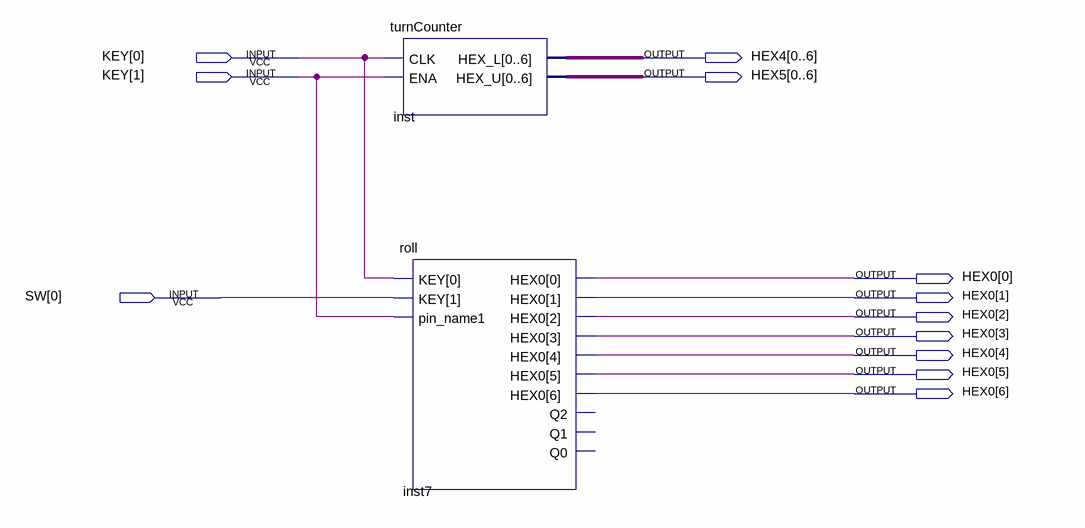
[diagram p0: schematic sheet]
// Quartus schematic lab6.bdf as structural Verilog: 2 symbols, 12 pins
module lab6 (
  input  [1:0] KEY,
  input  [0:0] SW,
  output [0:6] HEX4,
  output [0:6] HEX5,
  output [6:0] HEX0
);

  turnCounter inst (.CLK(KEY[0]), .ENA(KEY[1]), .HEX_L(HEX4), .HEX_U(HEX5));
  roll inst7 (.KEY({SW[0], KEY[0]}), .pin_name1(KEY[1]), .HEX0(HEX0));  // open: Q2, Q1, Q0
endmodule
